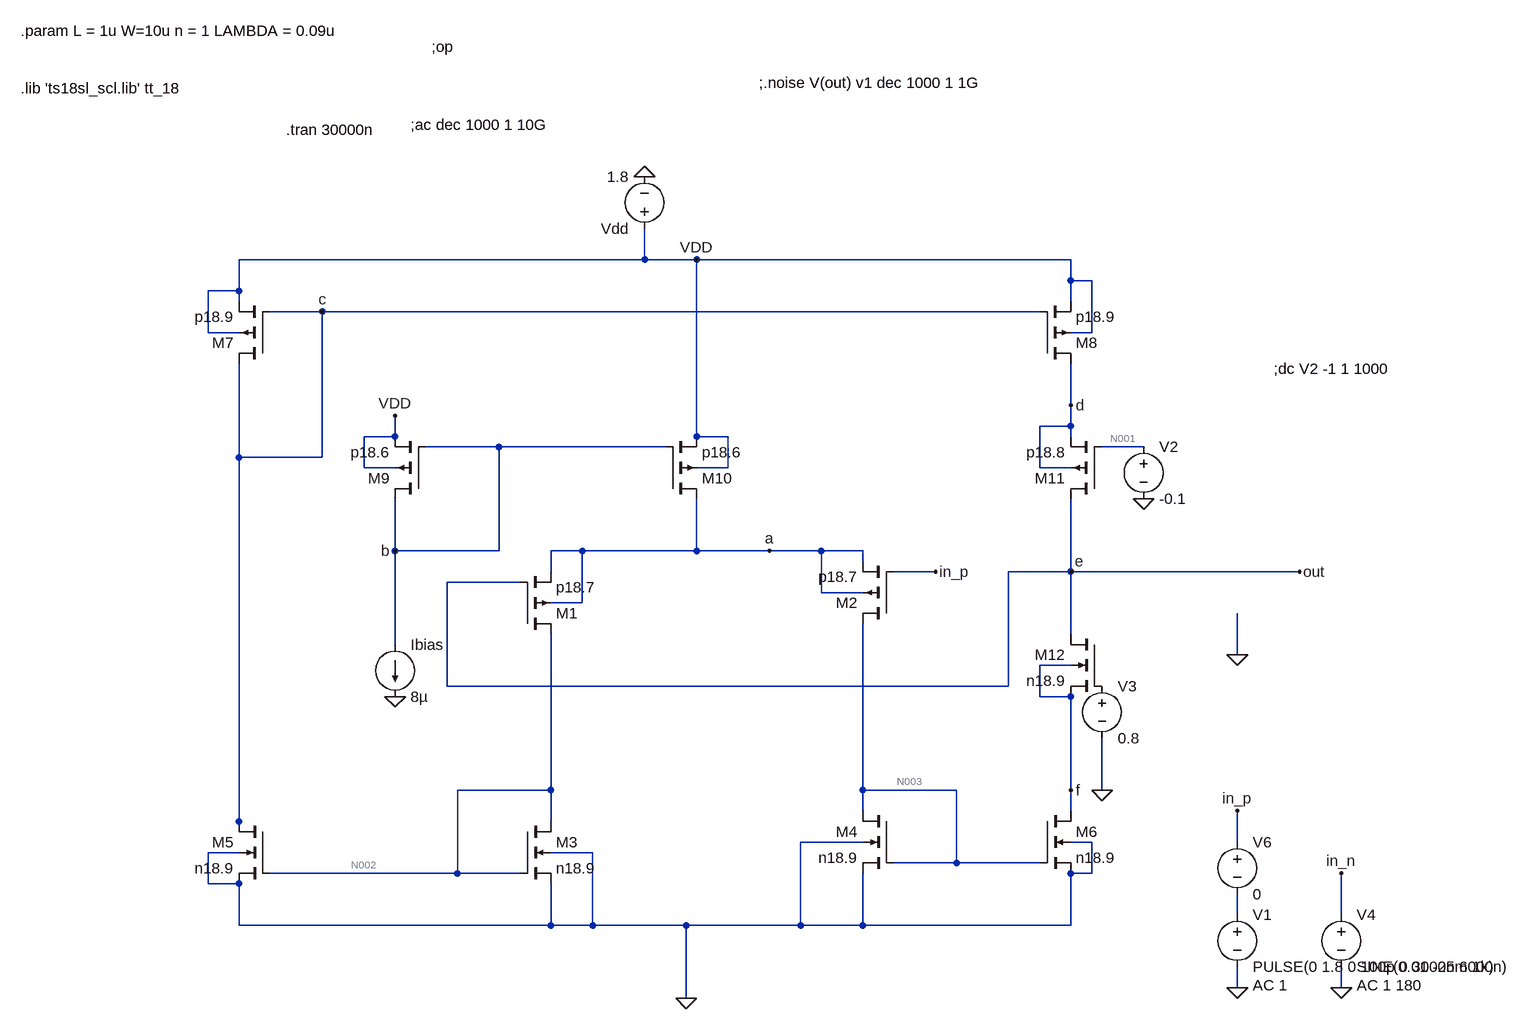
[diagram p0: schematic slewrate.asc]
slewrate.asc, the LTspice schematic file:
Version 4
SHEET 1 3032 1344
WIRE 432 80 432 32
WIRE 432 80 -192 80
WIRE 512 80 432 80
WIRE 1088 80 512 80
WIRE 1088 112 1088 80
WIRE 1120 112 1088 112
WIRE -192 128 -192 80
WIRE -192 128 -240 128
WIRE -192 144 -192 128
WIRE 1088 144 1088 112
WIRE -64 160 -144 160
WIRE 1040 160 -64 160
WIRE -240 192 -240 128
WIRE -192 192 -240 192
WIRE 1120 192 1120 112
WIRE 1120 192 1088 192
WIRE 1088 304 1088 240
WIRE 1088 336 1088 304
WIRE 1088 336 1040 336
WIRE 48 352 48 320
WIRE 48 352 0 352
WIRE 512 352 512 80
WIRE 560 352 512 352
WIRE 1088 352 1088 336
WIRE 208 368 96 368
WIRE 464 368 208 368
WIRE 1200 368 1136 368
WIRE -192 384 -192 240
WIRE -64 384 -64 160
WIRE -64 384 -192 384
WIRE 0 400 0 352
WIRE 48 400 0 400
WIRE 560 400 560 352
WIRE 560 400 512 400
WIRE 1040 400 1040 336
WIRE 1088 400 1040 400
WIRE 48 528 48 448
WIRE 208 528 208 368
WIRE 208 528 48 528
WIRE 336 528 288 528
WIRE 512 528 512 448
WIRE 512 528 336 528
WIRE 624 528 512 528
WIRE 704 528 624 528
WIRE 768 528 704 528
WIRE 768 544 768 528
WIRE 288 560 288 528
WIRE 880 560 816 560
WIRE 1088 560 1088 448
WIRE 1088 560 992 560
WIRE 1440 560 1088 560
WIRE 240 576 128 576
WIRE 704 592 704 528
WIRE 768 592 704 592
WIRE 336 608 336 528
WIRE 336 608 288 608
WIRE 1088 656 1088 560
WIRE 48 672 48 528
WIRE 1344 688 1344 624
WIRE 1088 704 1040 704
WIRE 128 736 128 576
WIRE 992 736 992 560
WIRE 992 736 128 736
WIRE 1040 752 1040 704
WIRE 1088 752 1040 752
WIRE 288 896 288 656
WIRE 288 896 144 896
WIRE 768 896 768 640
WIRE 912 896 768 896
WIRE 1088 896 1088 752
WIRE 1136 896 1136 816
WIRE 768 928 768 896
WIRE 1088 928 1088 896
WIRE -192 944 -192 384
WIRE 288 944 288 896
WIRE -192 960 -192 944
WIRE 768 976 672 976
WIRE 1120 976 1088 976
WIRE 1344 976 1344 928
WIRE -192 992 -240 992
WIRE 352 992 288 992
WIRE 912 1008 912 896
WIRE 912 1008 816 1008
WIRE 1040 1008 912 1008
WIRE 144 1024 144 896
WIRE 144 1024 -144 1024
WIRE 240 1024 144 1024
WIRE 1120 1024 1120 976
WIRE 1120 1024 1088 1024
WIRE -240 1040 -240 992
WIRE -192 1040 -240 1040
WIRE 1344 1088 1344 1056
WIRE 1504 1088 1504 1024
WIRE -192 1104 -192 1040
WIRE 288 1104 288 1040
WIRE 288 1104 -192 1104
WIRE 352 1104 352 992
WIRE 352 1104 288 1104
WIRE 496 1104 352 1104
WIRE 672 1104 672 976
WIRE 672 1104 496 1104
WIRE 768 1104 768 1024
WIRE 768 1104 672 1104
WIRE 1088 1104 1088 1024
WIRE 1088 1104 768 1104
WIRE 1344 1200 1344 1168
WIRE 1504 1200 1504 1168
WIRE 496 1216 496 1104
FLAG 48 752 0
FLAG 1440 560 out
FLAG 1344 688 0
FLAG 1344 1200 0
FLAG 880 560 in_p
FLAG 1344 928 in_p
FLAG 1136 896 0
FLAG 1200 448 0
FLAG 496 1216 0
FLAG 512 80 VDD
FLAG 48 320 VDD
FLAG 432 -48 0
FLAG 624 528 a
FLAG 48 528 b
FLAG 1504 1200 0
FLAG 1504 1024 in_n
FLAG -64 160 c
FLAG 1088 304 d
FLAG 1088 560 e
FLAG 1088 896 f
DATAFLAG -192 384 ""
DATAFLAG 1088 336 ""
DATAFLAG 1088 912 ""
DATAFLAG 1104 560 ""
DATAFLAG 192 368 ""
DATAFLAG 512 528 ""
DATAFLAG 912 1008 ""
DATAFLAG 256 1104 ""
SYMBOL nmos4 816 928 M0
SYMATTR InstName M4
SYMATTR Value n18.9
SYMATTR Value2 l=3u w=27u ad={5*W*LAMBDA} as={5*W*LAMBDA} pd={10*LAMBDA+2*W} ps={10*LAMBDA+2*W}
SYMBOL voltage 432 48 R180
WINDOW 123 0 0 Left 0
WINDOW 39 0 0 Left 0
SYMATTR InstName Vdd
SYMATTR Value 1.8
SYMBOL pmos4 464 448 M180
SYMATTR InstName M10
SYMATTR Value p18.6
SYMATTR Value2 l=1.2u w=1.2u ad={5*W*LAMBDA} as={5*W*LAMBDA} pd={10*LAMBDA+2*W} ps={10*LAMBDA+2*W}
SYMBOL pmos4 96 448 R180
SYMATTR InstName M9
SYMATTR Value p18.6
SYMATTR Value2 l=1.2u w=1.2u ad={5*W*LAMBDA} as={5*W*LAMBDA} pd={10*LAMBDA+2*W} ps={10*LAMBDA+2*W}
SYMBOL nmos4 240 944 R0
SYMATTR InstName M3
SYMATTR Value n18.9
SYMATTR Value2 l=3u w=27u ad={5*W*LAMBDA} as={5*W*LAMBDA} pd={10*LAMBDA+2*W} ps={10*LAMBDA+2*W}
SYMBOL pmos4 240 656 M180
SYMATTR InstName M1
SYMATTR Value p18.7
SYMATTR Value2 l=180n w=80u ad={5*W*LAMBDA} as={5*W*LAMBDA} pd={10*LAMBDA+2*W} ps={10*LAMBDA+2*W}
SYMBOL pmos4 816 640 R180
SYMATTR InstName M2
SYMATTR Value p18.7
SYMATTR Value2 l=180n w=80u ad={5*W*LAMBDA} as={5*W*LAMBDA} pd={10*LAMBDA+2*W} ps={10*LAMBDA+2*W}
SYMBOL pmos4 1040 240 M180
SYMATTR InstName M8
SYMATTR Value p18.9
SYMATTR Value2 l=9u w=2u ad={5*W*LAMBDA} as={5*W*LAMBDA} pd={10*LAMBDA+2*W} ps={10*LAMBDA+2*W}
SYMBOL pmos4 -144 240 R180
SYMATTR InstName M7
SYMATTR Value p18.9
SYMATTR Value2 l=9u w=2u ad={5*W*LAMBDA} as={5*W*LAMBDA} pd={10*LAMBDA+2*W} ps={10*LAMBDA+2*W}
SYMBOL nmos4 -144 944 M0
SYMATTR InstName M5
SYMATTR Value n18.9
SYMATTR Value2 l=3u w=27u ad={5*W*LAMBDA} as={5*W*LAMBDA} pd={10*LAMBDA+2*W} ps={10*LAMBDA+2*W}
SYMBOL nmos4 1040 928 R0
SYMATTR InstName M6
SYMATTR Value n18.9
SYMATTR Value2 l=3u w=27u ad={5*W*LAMBDA} as={5*W*LAMBDA} pd={10*LAMBDA+2*W} ps={10*LAMBDA+2*W}
SYMBOL current 48 672 R0
WINDOW 123 0 0 Left 0
WINDOW 39 0 0 Left 0
SYMATTR InstName Ibias
SYMATTR Value 8µ
SYMBOL pmos4 1136 448 R180
SYMATTR InstName M11
SYMATTR Value p18.8
SYMATTR Value2 l=1u w=90u ad={5*W*LAMBDA} as={5*W*LAMBDA} pd={10*LAMBDA+2*W} ps={10*LAMBDA+2*W}
SYMBOL nmos4 1136 656 M0
SYMATTR InstName M12
SYMATTR Value n18.9
SYMATTR Value2 l=5u w=40u ad={5*W*LAMBDA} as={5*W*LAMBDA} pd={10*LAMBDA+2*W} ps={10*LAMBDA+2*W}
SYMBOL voltage 1344 1072 R0
WINDOW 123 24 124 Left 2
WINDOW 39 0 0 Left 0
SYMATTR Value2 AC 1
SYMATTR InstName V1
SYMATTR Value PULSE(0 1.8 0 100p 0 3000n 6000n)
SYMBOL voltage 1200 352 R0
WINDOW 123 0 0 Left 0
WINDOW 39 0 0 Left 0
SYMATTR InstName V2
SYMATTR Value -0.1
SYMBOL voltage 1136 720 R0
WINDOW 123 0 0 Left 0
WINDOW 39 0 0 Left 0
SYMATTR InstName V3
SYMATTR Value 0.8
SYMBOL voltage 1504 1072 R0
WINDOW 123 24 124 Left 2
WINDOW 39 0 0 Left 0
SYMATTR Value2 AC 1 180
SYMATTR InstName V4
SYMATTR Value SINE(0.01 -25m 1k)
SYMBOL voltage 1344 960 R0
WINDOW 123 0 0 Left 0
WINDOW 39 0 0 Left 0
SYMATTR InstName V6
SYMATTR Value 0
TEXT -528 -184 Left 2 !.lib 'ts18sl_scl.lib' tt_18
TEXT -528 -272 Left 2 !.param L = 1u W=10u n = 1 LAMBDA = 0.09u
TEXT 104 -248 Left 2 !;op
TEXT 72 -128 Left 2 !;ac dec 1000 1 10G
TEXT 1400 248 Left 2 !;dc V2 -1 1 1000
TEXT 608 -192 Left 2 !;.noise V(out) v1 dec 1000 1 1G
TEXT -120 -120 Left 2 !.tran 30000n

The netlist it stands for:
* slewrate.asc
M4 N003 N003 0 0 n18.9 l=3u w=27u ad={5*W*LAMBDA} as={5*W*LAMBDA} pd={10*LAMBDA+2*W} ps={10*LAMBDA+2*W}
Vdd VDD 0 1.8
M10 a b VDD VDD p18.6 l=1.2u w=1.2u ad={5*W*LAMBDA} as={5*W*LAMBDA} pd={10*LAMBDA+2*W} ps={10*LAMBDA+2*W}
M9 b b VDD VDD p18.6 l=1.2u w=1.2u ad={5*W*LAMBDA} as={5*W*LAMBDA} pd={10*LAMBDA+2*W} ps={10*LAMBDA+2*W}
M3 N002 N002 0 0 n18.9 l=3u w=27u ad={5*W*LAMBDA} as={5*W*LAMBDA} pd={10*LAMBDA+2*W} ps={10*LAMBDA+2*W}
M1 N002 e a a p18.7 l=180n w=80u ad={5*W*LAMBDA} as={5*W*LAMBDA} pd={10*LAMBDA+2*W} ps={10*LAMBDA+2*W}
M2 N003 in_p a a p18.7 l=180n w=80u ad={5*W*LAMBDA} as={5*W*LAMBDA} pd={10*LAMBDA+2*W} ps={10*LAMBDA+2*W}
M8 d c VDD VDD p18.9 l=9u w=2u ad={5*W*LAMBDA} as={5*W*LAMBDA} pd={10*LAMBDA+2*W} ps={10*LAMBDA+2*W}
M7 c c VDD VDD p18.9 l=9u w=2u ad={5*W*LAMBDA} as={5*W*LAMBDA} pd={10*LAMBDA+2*W} ps={10*LAMBDA+2*W}
M5 c N002 0 0 n18.9 l=3u w=27u ad={5*W*LAMBDA} as={5*W*LAMBDA} pd={10*LAMBDA+2*W} ps={10*LAMBDA+2*W}
M6 f N003 0 0 n18.9 l=3u w=27u ad={5*W*LAMBDA} as={5*W*LAMBDA} pd={10*LAMBDA+2*W} ps={10*LAMBDA+2*W}
Ibias b 0 8µ
M11 e N001 d d p18.8 l=1u w=90u ad={5*W*LAMBDA} as={5*W*LAMBDA} pd={10*LAMBDA+2*W} ps={10*LAMBDA+2*W}
M12 e P001 f f n18.9 l=5u w=40u ad={5*W*LAMBDA} as={5*W*LAMBDA} pd={10*LAMBDA+2*W} ps={10*LAMBDA+2*W}
V1 N004 0 PULSE(0 1.8 0 100p 0 3000n 6000n) AC 1
V2 N001 0 -0.1
V3 P001 0 0.8
V4 in_n 0 SINE(0.01 -25m 1k) AC 1 180
V6 in_p N004 0
.model NMOS NMOS
.model PMOS PMOS
.lib standard.mos
.lib 'ts18sl_scl.lib' tt_18
.param L = 1u W=10u n = 1 LAMBDA = 0.09u
;op
;ac dec 1000 1 10G
;dc V2 -1 1 1000
;.noise V(out) v1 dec 1000 1 1G
.tran 30000n
.backanno
.end

* Results of the author's LTspice run, read from the files saved beside the schematic
* Operating Point, zero values left out:
*   V(n003) = 413.7 mV
*   V(vdd) = 1.8 V
*   V(a) = 429.9 mV
*   V(b) = 797.5 mV
*   V(n002) = 396.3 mV
*   V(e) = 43.77 mV
*   V(d) = 292.8 mV
*   V(c) = 602.8 mV
*   V(f) = 40.31 mV
*   V(n001) = -100 mV
*   V(p001) = 800 mV
*   V(in_n) = 10 mV
*   Id(M11) = -3.323 µA
*   Is(M11) = 3.323 µA
*   Id(M7) = -3.316 µA
*   Ib(M7) = 1.197 pA
*   Is(M7) = 3.316 µA
*   Id(M8) = -3.323 µA
*   Ib(M8) = 1.507 pA
*   Is(M8) = 3.323 µA
*   Id(M2) = -4.764 µA
*   Is(M2) = 4.764 µA
*   Id(M1) = -3.306 µA
*   Is(M1) = 3.306 µA
*   Id(M9) = -8 µA
*   Ib(M9) = 1.003 pA
*   Is(M9) = 8 µA
*   Id(M10) = -8.07 µA
*   Ib(M10) = 1.37 pA
*   Is(M10) = 8.07 µA
*   Id(M12) = 3.323 µA
*   Is(M12) = -3.323 µA
*   Id(M6) = 3.323 µA
*   Is(M6) = -3.323 µA
*   Id(M5) = 3.316 µA
*   Is(M5) = -3.316 µA
*   Id(M3) = 3.306 µA
*   Is(M3) = -3.306 µA
*   Id(M4) = 4.764 µA
*   Is(M4) = -4.764 µA
*   I(Ibias) = 8 µA
*   I(Vdd) = -22.71 µA
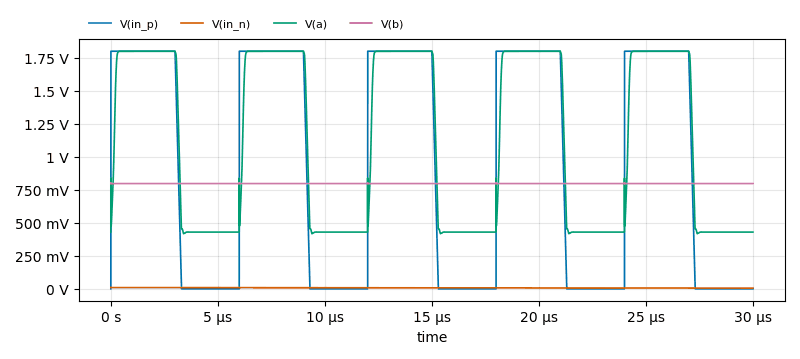
[diagram p1: Transient Analysis of slewrate.asc, plotted from the saved traces]
* Transient Analysis, 1 run:
*   V(in_p): min 0 V, max 1.8 V, average 945 mV, rms 1.294 V, last 0 V
*   V(in_n): min 5.315 mV, max 10 mV, average 7.651 mV, rms 7.77 mV, last 5.315 mV
*   V(a): min 417.6 mV, max 1.8 V, average 1.121 V, rms 1.303 V, last 429.9 mV
*   V(b): min 796.6 mV, max 803.3 mV, average 797.5 mV, rms 797.5 mV, last 797.5 mV